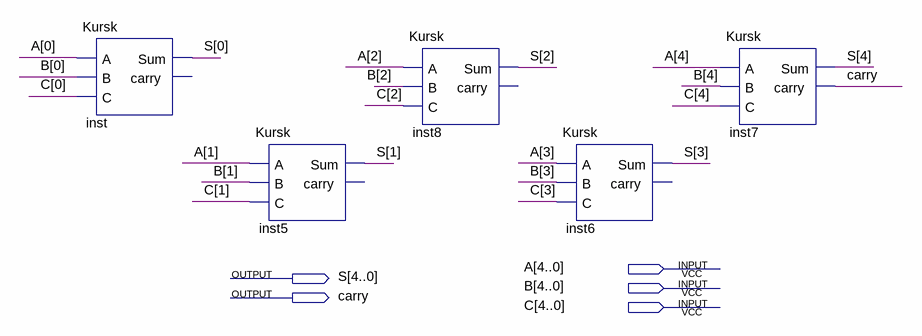
[diagram p0: schematic sheet]
// Quartus schematic 5razrad.bdf as structural Verilog: 5 symbols, 5 pins
module \5razrad  (
  input  [4:0] A,
  input  [4:0] B,
  input  [4:0] C,
  output [4:0] S,
  output carry
);

  Kursk inst (.A(A[0]), .B(B[0]), .C(C[0]), .Sum(S[0]));  // open: carry
  Kursk inst5 (.A(A[1]), .B(B[1]), .C(C[1]), .Sum(S[1]));  // open: carry
  Kursk inst8 (.A(A[2]), .B(B[2]), .C(C[2]), .Sum(S[2]));  // open: carry
  Kursk inst6 (.A(A[3]), .B(B[3]), .C(C[3]), .Sum(S[3]));  // open: carry
  Kursk inst7 (.A(A[4]), .B(B[4]), .C(C[4]), .Sum(S[4]), .carry(carry));
endmodule
